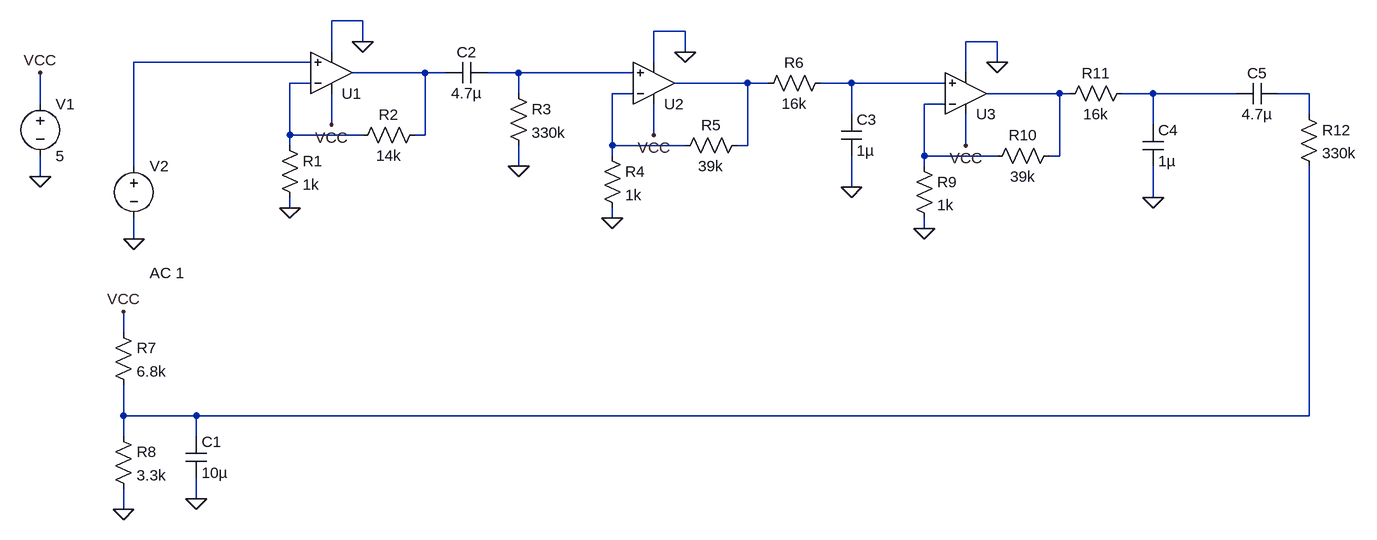
[diagram p0: schematic IF_amp.asc]
IF_amp.asc, the LTspice schematic file:
Version 4.1
SHEET 1 3092 772
WIRE 240 -272 192 -272
WIRE 736 -256 688 -256
WIRE 240 -240 240 -272
WIRE 1216 -240 1168 -240
WIRE 192 -224 192 -272
WIRE 736 -224 736 -256
WIRE 160 -208 -112 -208
WIRE 688 -208 688 -256
WIRE 1216 -208 1216 -240
WIRE 336 -192 224 -192
WIRE 368 -192 336 -192
WIRE 480 -192 432 -192
WIRE 656 -192 480 -192
WIRE 1168 -192 1168 -240
WIRE 160 -176 128 -176
WIRE 832 -176 720 -176
WIRE 864 -176 832 -176
WIRE 992 -176 944 -176
WIRE 1136 -176 992 -176
WIRE 480 -160 480 -192
WIRE 656 -160 624 -160
WIRE 1312 -160 1200 -160
WIRE 1328 -160 1312 -160
WIRE 1456 -160 1408 -160
WIRE 1584 -160 1456 -160
WIRE 1696 -160 1648 -160
WIRE -256 -144 -256 -192
WIRE 1136 -144 1104 -144
WIRE 992 -128 992 -176
WIRE 1696 -128 1696 -160
WIRE 192 -112 192 -160
WIRE 1456 -112 1456 -160
WIRE 128 -96 128 -176
WIRE 240 -96 128 -96
WIRE 336 -96 336 -192
WIRE 336 -96 320 -96
WIRE 688 -96 688 -144
WIRE 128 -80 128 -96
WIRE 624 -80 624 -160
WIRE 736 -80 624 -80
WIRE 832 -80 832 -176
WIRE 832 -80 816 -80
WIRE 1168 -80 1168 -128
WIRE 624 -64 624 -80
WIRE 1104 -64 1104 -144
WIRE 1216 -64 1104 -64
WIRE 1312 -64 1312 -160
WIRE 1312 -64 1296 -64
WIRE -112 -48 -112 -208
WIRE 480 -48 480 -80
WIRE 1104 -48 1104 -64
WIRE -256 -32 -256 -64
WIRE 992 -16 992 -64
WIRE 1456 0 1456 -48
WIRE 128 16 128 0
WIRE 624 32 624 16
WIRE 1104 48 1104 32
WIRE -112 64 -112 32
WIRE -128 208 -128 176
WIRE -128 336 -128 288
WIRE -16 336 -128 336
WIRE 1696 336 1696 -48
WIRE 1696 336 -16 336
WIRE -128 368 -128 336
WIRE -16 368 -16 336
WIRE -16 464 -16 432
WIRE -128 480 -128 448
FLAG -256 -32 0
FLAG -256 -192 VCC
FLAG -112 64 0
FLAG -16 464 0
FLAG -128 480 0
FLAG -128 176 VCC
FLAG 128 16 0
FLAG 240 -240 0
FLAG 192 -112 VCC
FLAG 480 -48 0
FLAG 624 32 0
FLAG 736 -224 0
FLAG 688 -96 VCC
FLAG 992 -16 0
FLAG 1104 48 0
FLAG 1216 -208 0
FLAG 1168 -80 VCC
FLAG 1456 0 0
SYMBOL voltage -256 -160 R0
WINDOW 123 0 0 Left 0
WINDOW 39 0 0 Left 0
SYMATTR InstName V1
SYMATTR Value 5
SYMBOL voltage -112 -64 R0
WINDOW 123 24 180 Left 2
WINDOW 39 0 0 Left 0
WINDOW 3 24 152 Left 2
SYMATTR Value2 AC 1
SYMATTR InstName V2
SYMATTR Value ""
SYMBOL res -144 192 R0
SYMATTR InstName R7
SYMATTR Value 6.8k
SYMBOL res -144 352 R0
SYMATTR InstName R8
SYMATTR Value 3.3k
SYMBOL cap -32 368 R0
SYMATTR InstName C1
SYMATTR Value 10µ
SYMBOL OpAmps\\UniversalOpAmp2 192 -192 M180
SYMATTR InstName U1
SYMBOL res 112 -96 R0
SYMATTR InstName R1
SYMATTR Value 1k
SYMBOL res 336 -112 R90
WINDOW 0 0 56 VBottom 2
WINDOW 3 32 56 VTop 2
SYMATTR InstName R2
SYMATTR Value 14k
SYMBOL cap 432 -208 R90
WINDOW 0 0 32 VBottom 2
WINDOW 3 32 32 VTop 2
SYMATTR InstName C2
SYMATTR Value 4.7µ
SYMBOL res 464 -176 R0
SYMATTR InstName R3
SYMATTR Value 330k
SYMBOL OpAmps\\UniversalOpAmp2 688 -176 M180
SYMATTR InstName U2
SYMBOL res 608 -80 R0
SYMATTR InstName R4
SYMATTR Value 1k
SYMBOL res 832 -96 R90
WINDOW 0 0 56 VBottom 2
WINDOW 3 32 56 VTop 2
SYMATTR InstName R5
SYMATTR Value 39k
SYMBOL res 960 -192 R90
WINDOW 0 0 56 VBottom 2
WINDOW 3 32 56 VTop 2
SYMATTR InstName R6
SYMATTR Value 16k
SYMBOL cap 976 -128 R0
SYMATTR InstName C3
SYMATTR Value 1µ
SYMBOL OpAmps\\UniversalOpAmp2 1168 -160 M180
SYMATTR InstName U3
SYMBOL res 1088 -64 R0
SYMATTR InstName R9
SYMATTR Value 1k
SYMBOL res 1312 -80 R90
WINDOW 0 0 56 VBottom 2
WINDOW 3 32 56 VTop 2
SYMATTR InstName R10
SYMATTR Value 39k
SYMBOL res 1424 -176 R90
WINDOW 0 0 56 VBottom 2
WINDOW 3 32 56 VTop 2
SYMATTR InstName R11
SYMATTR Value 16k
SYMBOL cap 1440 -112 R0
SYMATTR InstName C4
SYMATTR Value 1µ
SYMBOL cap 1648 -176 R90
WINDOW 0 0 32 VBottom 2
WINDOW 3 32 32 VTop 2
SYMATTR InstName C5
SYMATTR Value 4.7µ
SYMBOL res 1680 -144 R0
SYMATTR InstName R12
SYMATTR Value 330k

The netlist it stands for:
* IF_amp.asc
V1 VCC 0 5
V2 N001 0 AC 1
R7 VCC N012 6.8k
R8 N012 0 3.3k
C1 N012 0 10µ
X§U1 N001 N004 VCC 0 N002 level2 Avol=1Meg GBW=10Meg Slew=10Meg Ilimit=25m Rail=0 Vos=0 En=0 Enk=0 In=0 Ink=0 Rin=500Meg  ; pins In+ In- V+ V- OUT
R1 N004 0 1k
R2 N002 N004 14k
C2 N003 N002 4.7µ
R3 N003 0 330k
X§U2 N003 N007 VCC 0 N005 level2 Avol=1Meg GBW=10Meg Slew=10Meg Ilimit=25m Rail=0 Vos=0 En=0 Enk=0 In=0 Ink=0 Rin=500Meg  ; pins In+ In- V+ V- OUT
R4 N007 0 1k
R5 N005 N007 39k
R6 N006 N005 16k
C3 N006 0 1µ
X§U3 N006 N011 VCC 0 N008 level2 Avol=1Meg GBW=10Meg Slew=10Meg Ilimit=25m Rail=0 Vos=0 En=0 Enk=0 In=0 Ink=0 Rin=500Meg  ; pins In+ In- V+ V- OUT
R9 N011 0 1k
R10 N008 N011 39k
R11 N009 N008 16k
C4 N009 0 1µ
C5 N010 N009 4.7µ
R12 N010 N012 330k
.lib UniversalOpAmp2.lib
.backanno
.end